# EAGLE design LED_Cube (EAGLE 7.7.0)
ECE 411 LED Cube Practicum project
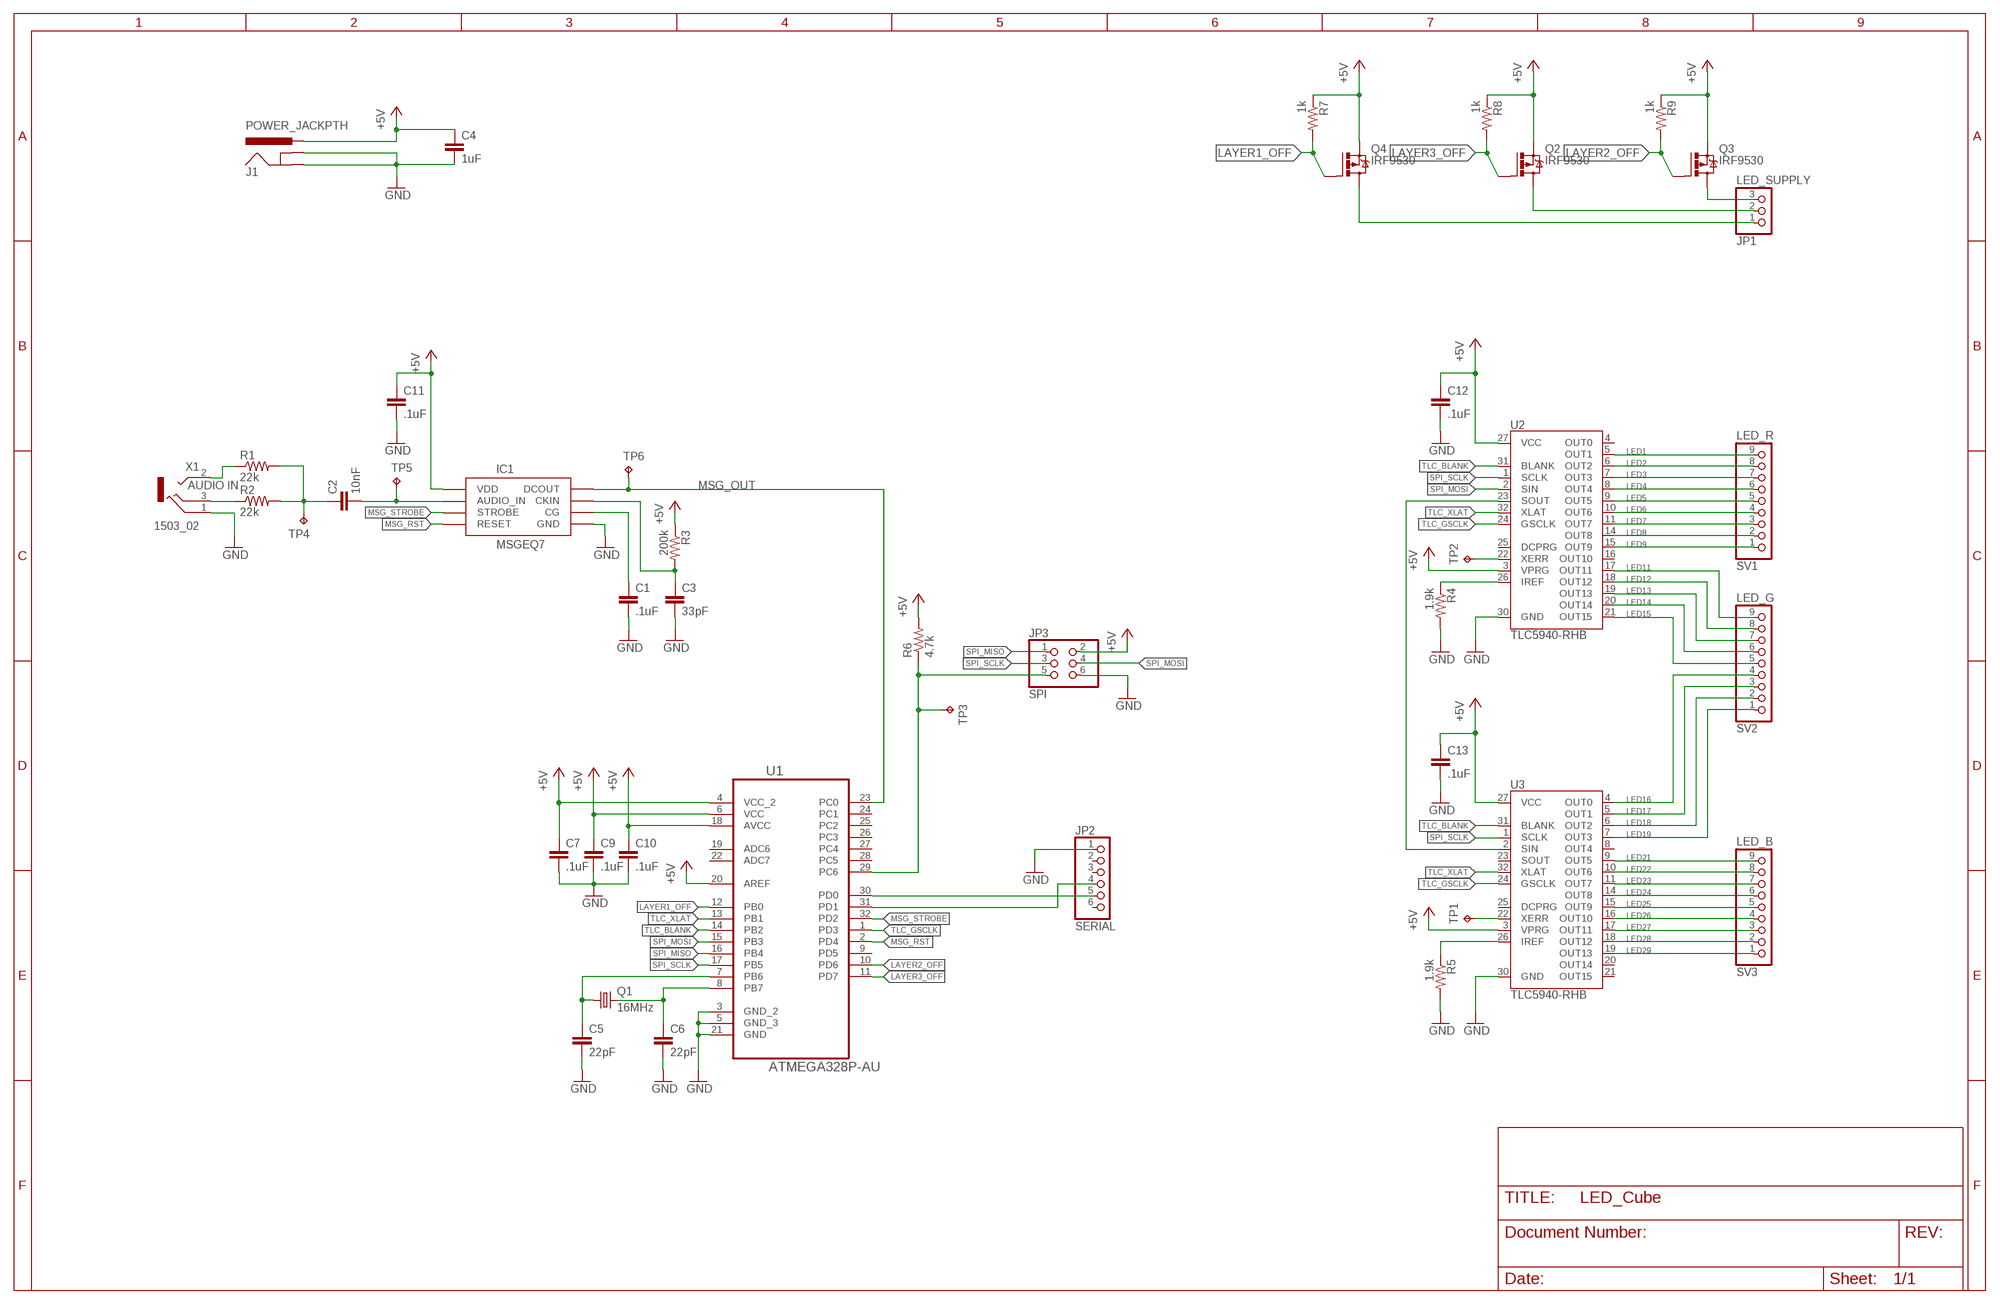
[diagram p0: schematic, sheet 1]

## Parts
C1  .1uF  C-EUC0805  [C0805]
C2  10nF  C-EUC0805  [C0805]
C3  33pF  C-EUC0805  [C0805]
C4  1uF  C-EUC0805  [C0805]
C5  22pF  C-EUC0805  [C0805]
C6  22pF  C-EUC0805  [C0805]
C7  .1uF  C-EUC0402  [C0402]
C9  .1uF  C-EUC0402  [C0402]
C10  .1uF  C-EUC0402  [C0402]
C11  .1uF  C-EUC0805  [C0805]
C12  .1uF  C-EUC0402  [C0402]
C13  .1uF  C-EUC0402  [C0402]
IC1  MSGEQ7SOIC  [SOIC8]
J1  POWER_JACKPTH  [POWER_JACK_PTH]
JP1  LED_SUPPLY  PINHD-1X3  [1X03]
JP2  SERIAL  PINHD-1X6  [1X06]
JP3  SPI  PINHD-2X3  [2X03]
Q1  16MHz  CRYSTALHC49UP  [HC49UP]
Q2  IRF9530  [TO220BV]
Q3  IRF9530  [TO220BV]
Q4  IRF9530  [TO220BV]
R1  22k  R-US_R0805  [R0805]
R2  22k  R-US_R0805  [R0805]
R3  200k  R-US_R0805  [R0805]
R4  1.9k  R-US_R0402  [R0402]
R5  1.9k  R-US_R0402  [R0402]
R6  4.7k  R-US_R0805  [R0805]
R7  1k  R-US_R0805  [R0805]
R8  1k  R-US_R0805  [R0805]
R9  1k  R-US_R0805  [R0805]
SV1  LED_R  PINHD-1X9  [1X09]
SV2  LED_G  PINHD-1X9  [1X09]
SV3  LED_B  PINHD-1X9  [1X09]
TP1  TPPAD1-13  [P1-13]
TP2  TPPAD1-13  [P1-13]
TP3  TPPAD1-13  [P1-13]
TP4  TPPAD1-13  [P1-13]
TP5  TPPAD1-13  [P1-13]
TP6  TPPAD1-13  [P1-13]
U1  ATMEGA328P-AU  [QFP80P900X900X120-32N]
U2  TLC5940-RHB  [QFN-32]
U3  TLC5940-RHB  [QFN-32]
X1  1503_02  [1503_02]

## Nets
+5V: C4.1 C7.1 C9.1 C10.1 C11.1 C12.1 C13.1 IC1.1(VDD) J1.PWR JP3.2 Q2.S Q3.S Q4.S R3.1 R6.2 R7.1 R8.1 R9.1 U1.4(VCC_2) U1.6(VCC) U1.18(AVCC) U1.20(AREF) U2.3(VPRG) U2.27(VCC) U3.3(VPRG) U3.27(VCC)
ATM_RST: JP3.5 R6.1 TP3.TP U1.29(PC6)
CRY_1: C5.1 Q1.1 U1.7(PB6)
CRY_2: C6.1 Q1.2 U1.8(PB7)
GND: C1.2 C3.2 C4.2 C5.2 C6.2 C7.2 C9.2 C10.2 C11.2 C12.2 C13.2 IC1.2(GND) J1.GND J1.GNDBREAK JP2.1 JP3.6 R4.2 R5.2 U1.3(GND_2) U1.5(GND_3) U1.21(GND) U2.30(GND) U3.30(GND) X1.1
LAY2_SUPPLY: JP1.3 Q3.D
LAY3_SUPPLY: JP1.2 Q2.D
LAY4_SUPPLY: JP1.1 Q4.D
LAYER1_OFF: Q4.G R7.2 U1.12(PB0)
LAYER2_OFF: Q3.G R9.2 U1.10(PD6)
LAYER3_OFF: Q2.G R8.2 U1.11(PD7)
LED1: SV1.9 U2.5(OUT1)
LED2: SV1.8 U2.6(OUT2)
LED3: SV1.7 U2.7(OUT3)
LED4: SV1.6 U2.8(OUT4)
LED5: SV1.5 U2.9(OUT5)
LED6: SV1.4 U2.10(OUT6)
LED7: SV1.3 U2.11(OUT7)
LED8: SV1.2 U2.14(OUT8)
LED9: SV1.1 U2.15(OUT9)
LED11: SV2.9 U2.17(OUT11)
LED12: SV2.8 U2.18(OUT12)
LED13: SV2.7 U2.19(OUT13)
LED14: SV2.6 U2.20(OUT14)
LED15: SV2.5 U2.21(OUT15)
LED16: SV2.4 U3.4(OUT0)
LED17: SV2.3 U3.5(OUT1)
LED18: SV2.2 U3.6(OUT2)
LED19: SV2.1 U3.7(OUT3)
LED21: SV3.9 U3.9(OUT5)
LED22: SV3.8 U3.10(OUT6)
LED23: SV3.7 U3.11(OUT7)
LED24: SV3.6 U3.14(OUT8)
LED25: SV3.5 U3.15(OUT9)
LED26: SV3.4 U3.16(OUT10)
LED27: SV3.3 U3.17(OUT11)
LED28: SV3.2 U3.18(OUT12)
LED29: SV3.1 U3.19(OUT13)
MSG_CG: C1.1 IC1.6(CG)
MSG_CKIN: C3.1 IC1.8(CKIN) R3.2
MSG_INPUT: C2.2 IC1.5(AUDIO_IN) TP5.TP
MSG_OUT: IC1.3(DCOUT) TP6.TP U1.23(PC0)
MSG_RST: IC1.7(RESET) U1.2(PD4)
MSG_STROBE: IC1.4(STROBE) U1.32(PD2)
N$1: R2.1 X1.3
N$2: R1.1 X1.2
N$35: JP2.4 U1.31(PD1)
SERIAL_RX: JP2.5 U1.30(PD0)
SPI_MISO: JP3.1 U1.16(PB4)
SPI_MOSI: JP3.4 U1.15(PB3) U2.2(SIN)
SPI_SCLK: JP3.3 U1.17(PB5) U2.1(SCLK) U3.1(SCLK)
TLC1_ERR: TP2.TP U2.22(XERR)
TLC1_IREF: R4.1 U2.26(IREF)
TLC2_ERR: TP1.TP U3.22(XERR)
TLC2_IREF: R5.1 U3.26(IREF)
TLC_BLANK: U1.14(PB2) U2.31(BLANK) U3.31(BLANK)
TLC_CHAIN: U2.23(SOUT) U3.2(SIN)
TLC_GSCLK: U1.1(PD3) U2.24(GSCLK) U3.24(GSCLK)
TLC_XLAT: U1.13(PB1) U2.32(XLAT) U3.32(XLAT)
UNFILTERED_INPUT: C2.1 R1.2 R2.2 TP4.TP
Unconnected: JP2.2 JP2.3 JP2.6 U1.9(PD5) U1.19(ADC6) U1.22(ADC7) U1.24(PC1) U1.25(PC2) U1.26(PC3) U1.27(PC4) U1.28(PC5) U2.4(OUT0) U2.16(OUT10) U2.25(DCPRG) U3.8(OUT4) U3.20(OUT14) U3.21(OUT15) U3.23(SOUT) U3.25(DCPRG) X1.2@2

## Notes on the sheet
- AUDIO IN

## Library data of the parts
C1-C7 C9-C13 = rcl:C-EU: CAPACITOR, European symbol
IC1 = msgeq7:MSGEQ7: 7-band graphic equalizer
J1 = SparkFun-Connectors:POWER_JACK: Power Jack This is the standard 5.5mm barrel jack for power. The PTH is the most common, proven, reliable, footprint. The Slot footprint only works if the mill layer is transmitted to the PCB fab house so be warned. Mating wall wart : TOL-00298 (and others); PROD_ID: CONN-08197
JP1 = pinhead:PINHD-1X3: PIN HEADER
JP2 = pinhead:PINHD-1X6: PIN HEADER
JP3 = pinhead:PINHD-2X3: PIN HEADER
Q1 = crystal:CRYSTAL: CRYSTAL; OC_FARNELL: unknown; OC_NEWARK: unknown
Q2-Q4 = transistor-power:IRF9530: P-CHANNEL HEXFET POWER-MOS-FET Source: http://www.irf.com/product-info/datasheets/data/irf9530.pdf
R1-R9 = rcl:R-US_: RESISTOR, American symbol
SV1-SV3 = pinhead:PINHD-1X9: PIN HEADER
TP1-TP6 = testpad:TP: Test pad
U1 = Atmel_By_element14_Batch_1-00:ATMEGA328P-AU: 8-bit Microcontroller with In-System Programmable Flash; MPN: ATMEGA328P-AU; OC_FARNELL: 1715486; OC_NEWARK: 14R4631; PACKAGE: TQFP-32; SUPPLIER: Atmel
U2 U3 = SparkFun-DigitalIC:TLC5940: 16-channel LED Driver with Dot Correction and Grayscale PWM Control The TLC5940 is a 16-channel, constant-current sink LED driver. Each channel has an individually adjustable 4096-step grayscale PWM brightness control and a 64-step, constant-current sink (dot correction). The dot correction adjusts the brightness variations between LED channels and other LED drivers. The dot correction data is stored in an integrated EEPROM. Both grayscale control and dot correction are accessible via a serial interface. A single external resistor sets the maximum current value of all 16 channels. Packages: 28-pin HTSSOP 32-pin 5x5mm QFN 28-pin DIP; PROD_ID: IC-10398
X1 = con-lumberg:1503_02: Jack connectors according to JISC 6560, 3.5 mm Klinkeneinbaukupplung nach JISC 6560, 3,5 mm, 3-polig/stereo, abgewinkelte Ausführung, Surface-Mount-Technik (SMT) Source: http://www.lumberg.com/Produkte/PDFs/1503_02.pdf; OC_FARNELL: 1216979; OC_NEWARK: unknown

## Board
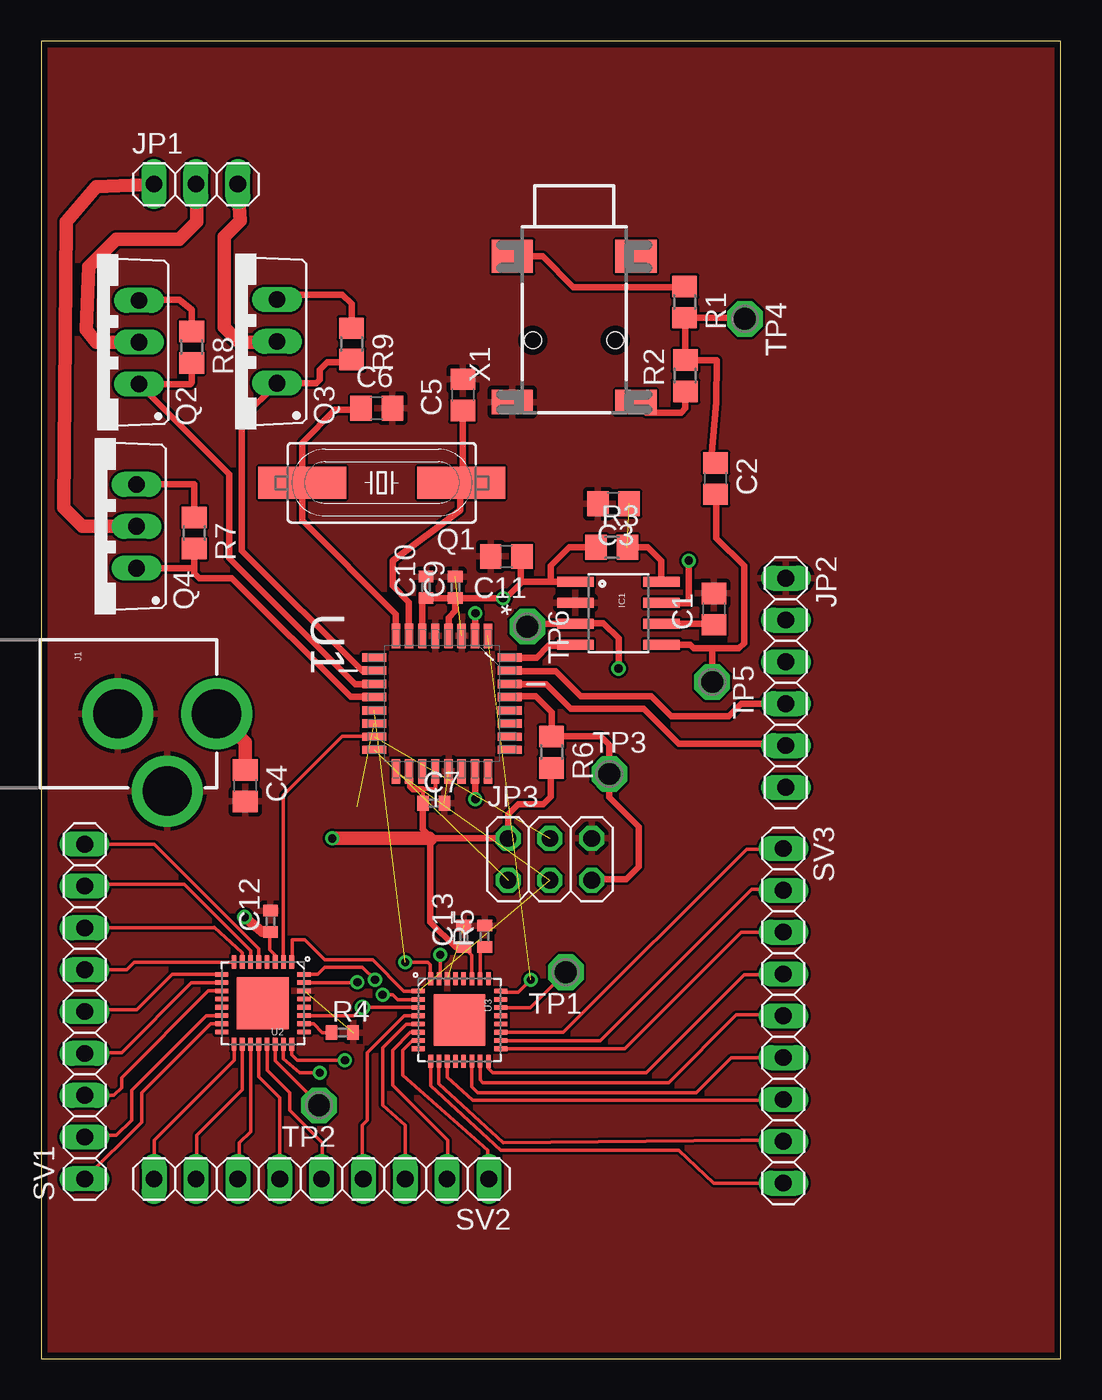
[diagram p1: board, top side]
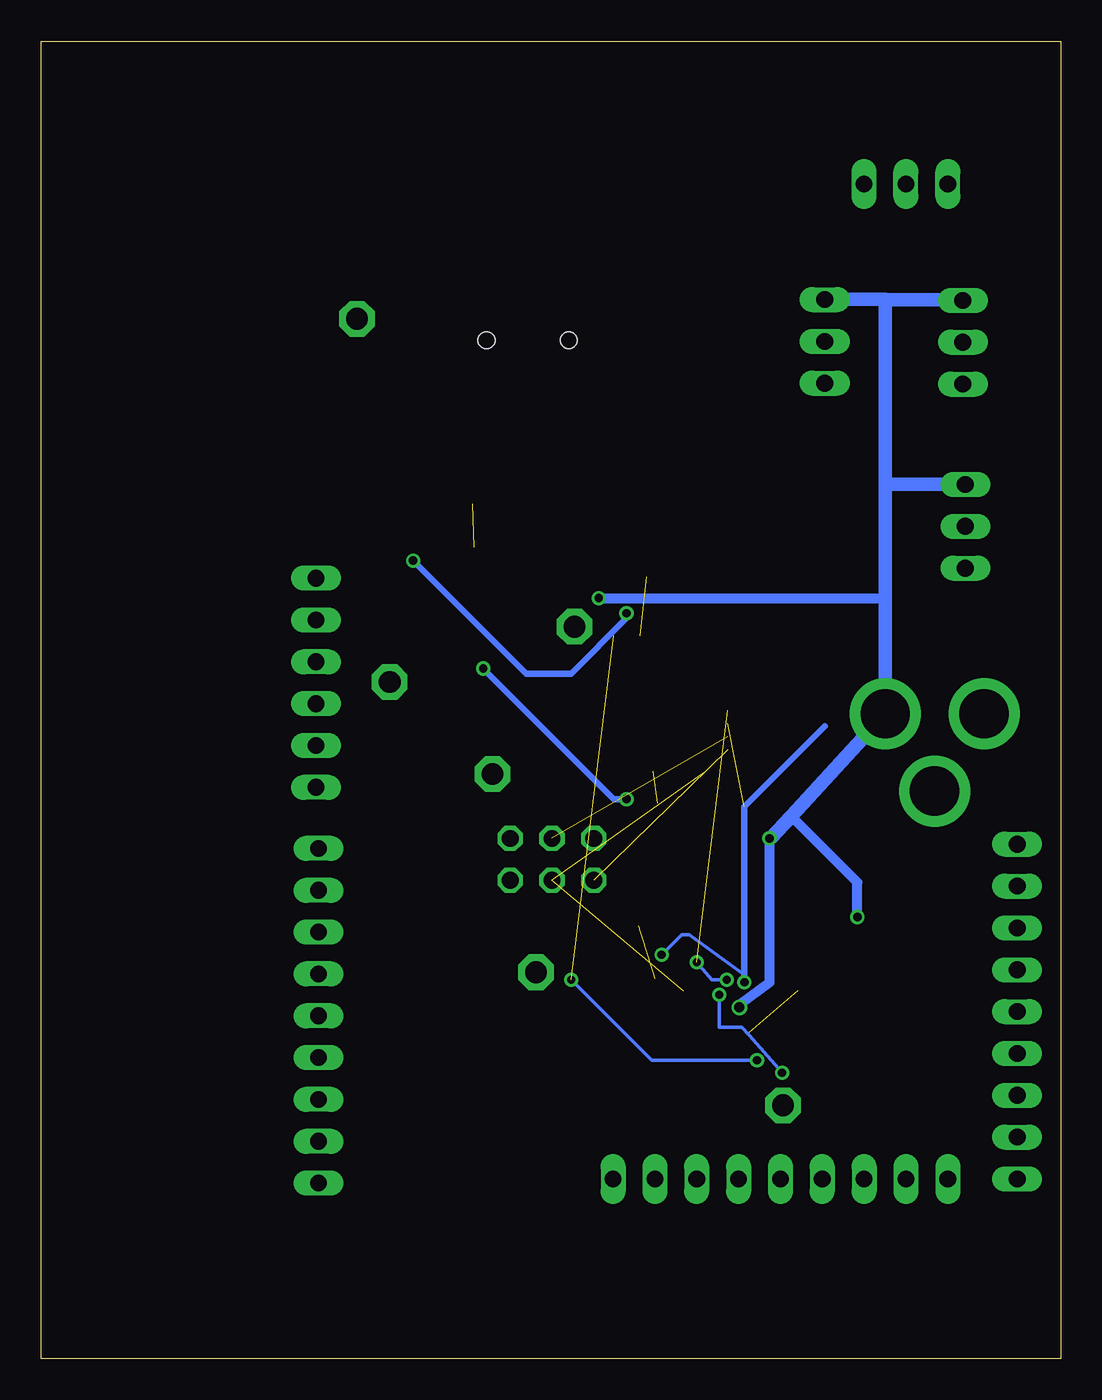
[diagram p2: board, bottom side, seen from below]

Size 61.9 x 80 mm. Coordinates in mm from the lower left corner, seen from the top.
Outline: 0,0 61.9,0 61.9,80 0,80 0,0
Copper layers (1*16): Top 0.0356mm / dielectric 1.5011mm / Bottom 0.0356mm
Design rules "oshpark-2layer": minimum track width 6mil, minimum drill 13mil, track to track 6mil, track to pad 6mil, pad to pad 6mil, via to via 6mil, smd to smd 6mil, copper to edge 15mil, drill to drill 6mil, minimum pad ring 7mil, minimum via ring 7mil, stop-mask expansion 2.5mil, vias tented up to drill 0mil, thermal gap 10mil

### Footprints (pad centres in the part's own frame; a part is rotated, then mirrored left to right if it is on the bottom)
C0805 = smd 1.3 x 1.5: 1 -0.95,0; 2 0.95,0
C0402 = smd 0.7 x 0.9: 1 -0.65,0; 2 0.65,0
SOIC8 = smd 0.61 x 2.21: 1 -1.905,-2.616; 2 -0.635,-2.616; 3 0.635,-2.616; 4 1.905,-2.616; 5 1.905,2.616; 6 0.635,2.616; 7 -0.635,2.616; 8 -1.905,2.616
POWER_JACK_PTH = drill 2.997 pad 4.318: GND 0,7.7; GNDBREAK 4.7,10.7; PWR 0,13.7
1X03 = drill 1.016 long: 1 -2.54,0; 2 0,0; 3 2.54,0
1X06 = drill 1.016 long: 1 -6.35,0; 2 -3.81,0; 3 -1.27,0; 4 1.27,0; 5 3.81,0; 6 6.35,0
2X03 = drill 1.016 octagon: 1 -2.54,-1.27; 2 -2.54,1.27; 3 0,-1.27; 4 0,1.27; 5 2.54,-1.27; 6 2.54,1.27
HC49UP = smd 5.334 x 1.93: 1 -4.826,0; 2 4.826,0
TO220BV = drill 1.016 long: D 0,-2.54; G -2.54,-2.54; S 2.54,-2.54
R0805 = smd 1.3 x 1.5: 1 -0.95,0; 2 0.95,0
R0402 = smd 0.7 x 0.9: 1 -0.65,0; 2 0.65,0
1X09 = drill 1.016 long: 1 -10.16,0; 2 -7.62,0; 3 -5.08,0; 4 -2.54,0; 5 0,0; 6 2.54,0; 7 5.08,0; 8 7.62,0; 9 10.16,0
P1-13 = drill 1.321 pad 2.159 octagon: TP 0,0
QFP80P900X900X120-32N = smd 1.473 x 0.508: 1 -4.115,2.794; 2 -4.115,2.007; 3 -4.115,1.194; 4 -4.115,0.406; 5 -4.115,-0.406; 6 -4.115,-1.194; 7 -4.115,-2.007; 8 -4.115,-2.794; 17 4.115,-2.794; 18 4.115,-2.007; 19 4.115,-1.194; 20 4.115,-0.406; 21 4.115,0.406; 22 4.115,1.194; 23 4.115,2.007; 24 4.115,2.794 | smd 0.508 x 1.473: 9 -2.794,-4.115; 10 -2.007,-4.115; 11 -1.194,-4.115; 12 -0.406,-4.115; 13 0.406,-4.115; 14 1.194,-4.115; 15 2.007,-4.115; 16 2.794,-4.115; 25 2.794,4.115; 26 2.007,4.115; 27 1.194,4.115; 28 0.406,4.115; 29 -0.406,4.115; 30 -1.194,4.115; 31 -2.007,4.115; 32 -2.794,4.115
QFN-32 = smd 0.285 x 0.8: 1 -1.75,-2.5; 2 -1.25,-2.5; 3 -0.75,-2.5; 4 -0.25,-2.5; 5 0.25,-2.5; 6 0.75,-2.5; 7 1.25,-2.5; 8 1.75,-2.5; 17 1.75,2.5; 18 1.25,2.5; 19 0.75,2.5; 20 0.25,2.5; 21 -0.25,2.5; 22 -0.75,2.5; 23 -1.25,2.5; 24 -1.75,2.5 | smd 0.8 x 0.285: 9 2.5,-1.75; 10 2.5,-1.25; 11 2.5,-0.75; 12 2.5,-0.25; 13 2.5,0.25; 14 2.5,0.75; 15 2.5,1.25; 16 2.5,1.75; 25 -2.5,1.75; 26 -2.5,1.25; 27 -2.5,0.75; 28 -2.5,0.25; 29 -2.5,-0.25; 30 -2.5,-0.75; 31 -2.5,-1.25; 32 -2.5,-1.75 | smd 3.15 x 3.15: EP 0,0
1503_02 = smd 2.5 x 1.5: 1 -3.75,-10.75; 3 3.75,-10.75 | smd 2.5 x 2: 2 -3.75,-1.9; 2@2 3.75,-1.9 | hole 1: -2.5,-7; 2.5,-7

### Placement (x,y rotation side)
C1  40.84,45.52 90 top
C2  40.94,53.44 270 top
C3  34.75,51.92 180 top
C4  12.4,34.8 270 top
C5  25.6,58.52 90 top
C6  20.37,57.71 0 top
C7  23.83,33.73 0 top
C9  25.15,46.84 90 top
C10  23.37,46.84 90 top
C11  28.24,48.72 180 top
C12  13.92,26.57 90 top
C13  25.65,25.65 90 top
IC1  35.05,45.26 270 top
J1  -3.05,39.17 270 top
JP1  9.4,71.32 0 top
JP2  45.21,41.05 270 top
JP3  30.89,30.33 0 top
Q1  20.68,53.19 180 top
Q2  3.4,61.72 90 top
Q3  11.79,61.77 90 top
Q4  3.25,50.55 90 top
R1  39.07,64.16 270 top
R2  39.12,59.69 90 top
R3  34.65,49.28 0 top
R4  18.29,19.81 0 top
R5  26.92,25.65 90 top
R6  30.99,36.83 270 top
R7  9.3,50.14 270 top
R8  9.14,61.42 270 top
R9  18.85,61.62 270 top
SV1  2.64,21.08 90 top
SV2  17.02,10.92 180 top
SV3  45.06,20.83 270 top
TP1  31.85,23.47 180 top
TP2  16.87,15.39 180 top
TP3  34.49,35.51 0 top
TP4  42.72,63.14 270 top
TP5  40.74,41.1 270 top
TP6  29.51,44.45 270 top
U1  24.33,39.78 270 top
U2  13.46,21.59 180 top
U3  25.4,20.57 270 top
X1  32.36,68.83 0 top

### Tracks (layer width: path | path; a pad name or v marks a point on that pad's centre or on a via)
+5V  (via drill 0.5, 0.6)
  Top 0.203: U2.27 19.01,20.84 v19.51,21.34 22.89,21.34 U3.3 | U3.27 26.15,24.51 C13.1 | U2.3 14.21,24.5 13.87,24.84 13.87,25.87 C12.1
  Top 0.254: U1.20 23.93,34.59 23.16,34.59 23.16,33.74 C7.1
  Top 0.406: 23.62,31.7 23.72,31.6 JP3.2 28.35,33.07 28.96,33.68 30.48,33.68 30.94,34.14 30.94,35.83 R6.2 | 23.62,31.7 23.16,32.16 23.16,33.72 C7.1 | R8.1 9.14,63.7 8.38,64.31 5.99,64.31 Q2.S | R7.1 9.3,53.09 Q4.S | R9.1 18.85,64.06 18.29,64.62 14.63,64.62 Q3.S | U1.6 23.14,45.96 C10.1 C9.1 | C9.1 v28.04,46.19 28.2,46.19 29.11,47.09 | 29.11,47.09 29.11,48.33 C11.1 | IC1.1 30.94,47.17 | 30.94,47.17 29.18,47.17 29.11,47.09 | R3.1 32.05,49.28 30.94,48.16 30.94,47.17 | U1.4 24.74,45.01 25.15,45.41 C9.1 | C13.1 25.14,25 23.62,26.52 23.62,31.55 23.62,31.7 | 23.16,34.59 22.55,34.59 22.4,34.75 22.4,35.59 U1.18
  Top 0.61: C12.1 13.4,25.92 v12.34,26.82
  Top 0.813: C4.1 12.39,37.42 J1.PWR | v17.68,31.6 23.57,31.6 23.62,31.55
  Bottom 0.406: 10.66,46.19 10.65,46.18
  Bottom 0.61: v19.51,21.34 19.51,21.49 17.68,22.86 v17.68,31.6 | v28.04,46.19 10.66,46.19 | v12.34,26.82 12.34,28.93 16.37,32.95
  Bottom 0.813: 10.65,53.19 10.65,46.18 J1.PWR 16.37,32.95 17.61,31.6 v17.68,31.6 | 10.65,53.19 10.65,64.33 | 10.65,64.33 10.52,64.31 5.99,64.31 Q2.S | 10.65,64.33 13.88,64.33 Q3.S | Q4.S 10.55,53.09 10.65,53.19
ATM_RST
  Top 0.406: JP3.5 33.48,29.11 35.51,29.11 36.27,29.87 36.27,32.31 34.49,34.09 TP3.TP 34.49,37.29 33.98,37.8 31,37.8 R6.1 30.99,39.27 30.02,40.23 28.5,40.23 U1.29
CRY_1
  Top 0.406: C5.1 25.6,53.29 Q1.1 25.45,53.14 25.45,51.51 21.34,48.46 21.34,46.94 22.33,45.95 U1.7
CRY_2
  Top 0.406: C6.1 19.32,57.61 17.83,57.61 15.85,55.63 Q1.2 15.85,50.9 21.54,45.21 U1.8
GND  (4 unrouted)
  pour Top: 0,80.01 0,0 61.98,0 61.98,80.01
LAY2_SUPPLY
  Top 0.813: JP1.3 12.09,69.09 11.12,68.12 11.12,62.64 12.04,61.72 14.28,61.72 Q3.D
LAY3_SUPPLY
  Top 0.813: Q2.D 3.35,61.72 2.74,62.48 2.9,66.29 4.57,67.97 8.38,67.97 9.45,69.04 9.45,71.98 JP1.2
LAY4_SUPPLY
  Top 0.813: Q4.D 2.49,50.55 1.37,51.66 1.52,69.04 3.35,71.17 JP1.1
LAYER1_OFF
  Top 0.406: U1.12 18.8,40.18 11.58,47.4 9.6,47.4 9.3,47.7 9.3,48.16 | 9.3,48.16 R7.2 | Q4.G 9.14,48.01 9.3,48.16
LAYER2_OFF
  Top 0.406: U1.10 19.48,41.78 12.19,49.07 12.19,57.1 Q3.G 16.71,59.23 16.92,59.44 16.92,60.05 17.37,60.5 18.68,60.5 R9.2
LAYER3_OFF
  Top 0.406: U1.11 19.07,40.97 11.43,48.62 11.43,53.7 Q2.G 9.04,59.18 9.14,59.28 R8.2
LED1
  Top 0.203: U2.5 13.21,24.89 6.86,31.24 SV1.9
LED2
  Top 0.203: U2.6 12.71,24.78 8.69,28.8 2.74,28.8 SV1.8
LED3
  Top 0.203: U2.7 12.21,24.67 10.52,26.21 10.46,26.16 SV1.7
LED4
  Top 0.203: U2.8 5.65,24.09 5.18,23.62 SV1.6
LED5
  Top 0.203: U2.9 7.95,23.34 5.79,21.18 2.74,21.18 SV1.5
LED6
  Top 0.203: U2.10 9.12,22.84 4.88,18.59 2.69,18.59 SV1.4
LED7
  Top 0.203: U2.11 10.15,22.34 4.88,17.07 4.88,16.46 4.42,16 SV1.3
LED8
  Top 0.203: U2.14 10.02,20.84 5.49,16.31 5.49,14.48 4.57,13.56 2.74,13.56 SV1.2
LED9
  Top 0.203: U2.15 10.28,20.34 6.1,16.15 6.1,14.38 SV1.1
LED11
  Top 0.203: U2.17 11.71,18.11 6.86,13.26 SV2.9
LED12
  Top 0.203: U2.18 12.21,16.33 9.45,13.56 9.45,10.97 SV2.8
LED13
  Top 0.203: U2.19 12.71,13.78 12.04,13.11 12.04,11.02 SV2.7
LED14
  Top 0.203: U2.20 13.21,17.12 14.48,15.85 SV2.6
LED15
  Top 0.203: U2.21 13.71,17.53 15.09,16.15 15.09,15.09 17.07,13.11 17.07,10.97 SV2.5
LED16
  Top 0.203: U3.4 22.04,20.82 19.81,18.59 19.81,14.48 19.51,14.17 19.51,10.97 SV2.4
LED17
  Top 0.203: U3.5 22.15,20.32 20.73,18.9 20.73,15.39 22.1,14.17 SV2.3
LED18
  Top 0.203: U3.6 22.41,19.82 21.34,18.75 21.34,16.61 24.69,13.26 24.69,10.97 SV2.2
LED19
  Top 0.203: U3.7 22.52,19.32 21.95,18.75 21.95,17.22 27.13,12.65 27.13,10.97 SV2.1
LED21
  Top 0.203: U3.9 23.65,16.58 27.89,12.65 38.71,12.65 40.84,10.67 SV3.9
LED22
  Top 0.203: U3.10 24.15,16.69 28.04,13.11 42.52,13.26 45.01,13.26 SV3.8
LED23
  Top 0.203: U3.11 24.65,17.11 26.21,15.7 44.7,15.7 SV3.7
LED24
  Top 0.203: U3.14 26.15,16.52 26.52,16.15 39.78,16.15 41.91,18.29 SV3.6
LED25
  Top 0.203: U3.15 26.65,16.94 26.82,16.76 38.1,16.76 42.22,20.88 45.01,20.88 SV3.5
LED26
  Top 0.203: U3.16 27.15,17.66 27.43,17.37 36.73,17.37 42.67,23.32 45.01,23.32 SV3.4
LED27
  Top 0.203: U3.17 35.44,18.82 42.52,25.91 SV3.3
LED28
  Top 0.203: U3.18 33.95,19.32 43.13,28.5 45.01,28.5 SV3.2
LED29
  Top 0.203: U3.19 31.71,19.82 42.82,30.94 45.01,30.94 SV3.1
MSG_CG
  Top 0.406: IC1.6 40.78,44.63 C1.1
MSG_CKIN  (1 unrouted)
  Top 0.406: R3.2 36.83,49.28 37.64,48.46 37.64,47.19 IC1.8
MSG_INPUT
  Top 0.406: IC1.5 39.4,43.36 39.62,43.13 40.69,43.13 | 40.69,43.13 42.37,43.13 42.67,43.43 42.67,48.16 41,49.84 41,52.44 C2.2 | TP5.TP 40.74,43.08 40.69,43.13
MSG_OUT  (via drill 0.5)
  Top 0.406: TP6.TP 29.69,44.63 IC1.3 32.46,44.65 34.14,44.65 35.05,43.74 v35.05,41.91 | U1.23 26.34,34.01 v26.36,33.98
  Bottom 0.406: v26.36,33.98 27.13,33.98 v35.05,41.91
MSG_RST  (via drill 0.5)
  Top 0.406: U1.2 26.34,45.24 v26.36,45.26 | v39.32,48.46 39.32,45.87 37.69,45.87 IC1.7
  Bottom 0.406: v26.36,45.26 26.36,44.96 29.72,41.6 32.46,41.6 v39.32,48.46
MSG_STROBE
  Top 0.406: U1.32 30.07,42.57 30.79,43.28 32.36,43.28 IC1.4
N$1
  Top 0.406: R2.1 39.12,57.71 38.86,57.45 36.74,57.45 X1.3
N$2
  Top 0.406: X1.2 30.45,66.93 32.31,65.08 39.33,65.08 R1.1
N$35
  Top 0.406: JP2.4 42.52,39.78 41.76,39.01 38.25,39.01 37.03,40.23 32.77,40.23 31.24,41.76 28.47,41.76 U1.31
SERIAL_RX
  Top 0.406: U1.30 30.66,40.97 32.16,39.47 36.58,39.47 38.71,37.34 45.11,37.34 JP2.5
SPI_MISO  (1 unrouted)
SPI_MOSI  (1 unrouted)
  Top 0.203: U2.2 14.71,34.22 18.29,37.8 20.19,37.8 U1.15
SPI_SCLK  (2 unrouted)
  Top 0.203: U3.1 22.02,22.32 20.12,24.23 17.22,24.23 16,25.45 15.24,25.45 15.24,24.12 U2.1
TLC1_ERR
  Top 0.203: U2.22 14.21,18.1 16.87,15.44 TP2.TP
TLC1_IREF
  Top 0.203: U2.26 16.54,20.34 17.07,19.81 R4.1
TLC2_ERR
  Top 0.203: U3.22 29.71,21.32 TP1.TP
TLC2_IREF
  Top 0.203: U3.26 26.65,24.73 R5.1
TLC_BLANK  (via drill 0.5)  (1 unrouted)
  Top 0.203: U2.31 18.88,22.84 v19.2,22.86 | v24.23,24.54 24.23,23.16 U3.31
  Bottom 0.203: v19.2,22.86 19.2,23.16 19.2,23.32 22.55,25.76 23.01,25.76 v24.23,24.54
  Bottom 0.406: 19.2,23.16 19.2,33.53 14.33,38.41
TLC_CHAIN  (via drill 0.5)
  Top 0.203: U2.23 14.71,18.21 15.7,17.37 v16.92,17.37 | v20.73,22.1 21.34,22.1 21.64,21.79 22.87,21.79 U3.2
  Bottom 0.203: v16.92,17.37 18.9,19.66 19.36,20.12 20.73,20.12 v20.73,22.1
TLC_GSCLK  (via drill 0.5)  (1 unrouted)
  Top 0.203: U2.24 15.21,18.47 15.54,18.14 v18.44,18.14 | v29.72,23.01 28.96,22.25 27.97,22.25 U3.24
  Bottom 0.203: v18.44,18.14 24.84,18.14 v29.72,23.01
TLC_XLAT  (via drill 0.5)  (1 unrouted)
  Top 0.203: U2.32 16.79,23.34 17.22,23.77 19.51,23.77 v20.27,23.01 | v22.1,24.08 23.47,24.08 23.62,23.93 23.62,23.1 U3.32
  Bottom 0.203: v20.27,23.01 21.18,23.01 v22.1,24.08
UNFILTERED_INPUT
  Top 0.406: TP4.TP 42.66,63.21 R1.2 39.12,63.16 R2.2 41.01,60.64 41,58.06 40.69,54.65 C2.1